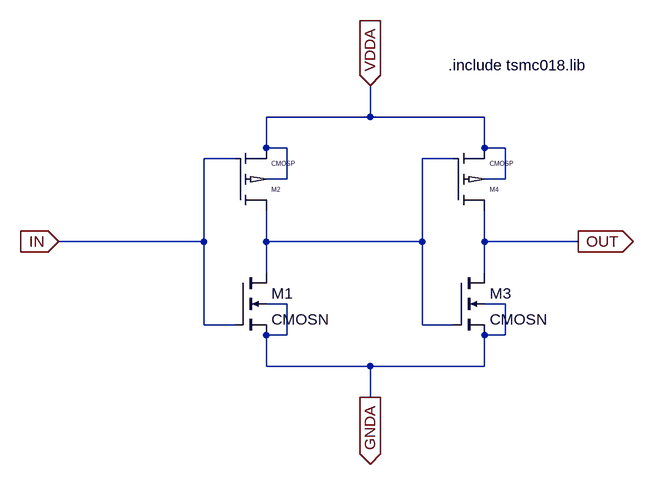
[diagram p0: schematic Matched_Buffer.asc]
Matched_Buffer.asc, the LTspice schematic file:
Version 4
SHEET 1 880 680
WIRE 224 -16 224 -64
WIRE 224 -16 64 -16
WIRE 400 -16 224 -16
WIRE 64 32 64 -16
WIRE 96 32 64 32
WIRE 400 32 400 -16
WIRE 432 32 400 32
WIRE 16 48 -32 48
WIRE 352 48 304 48
WIRE 96 80 96 32
WIRE 96 80 64 80
WIRE 432 80 432 32
WIRE 432 80 400 80
WIRE -32 176 -32 48
WIRE -32 176 -256 176
WIRE 64 176 64 128
WIRE 304 176 304 48
WIRE 304 176 64 176
WIRE 400 176 400 128
WIRE 544 176 400 176
WIRE 64 224 64 176
WIRE 400 224 400 176
WIRE 96 272 64 272
WIRE 432 272 400 272
WIRE -32 304 -32 176
WIRE 16 304 -32 304
WIRE 304 304 304 176
WIRE 352 304 304 304
WIRE 96 320 96 272
WIRE 96 320 64 320
WIRE 432 320 432 272
WIRE 432 320 400 320
WIRE 64 368 64 320
WIRE 224 368 64 368
WIRE 400 368 400 320
WIRE 400 368 224 368
WIRE 224 416 224 368
FLAG 224 -64 VDDA
IOPIN 224 -64 In
FLAG 224 416 GNDA
IOPIN 224 416 Out
FLAG -256 176 IN
IOPIN -256 176 In
FLAG 544 176 OUT
IOPIN 544 176 Out
SYMBOL cmosn 16 224 R0
SYMATTR InstName M1
SYMATTR Value2 l=180n w=1u
SYMBOL cmosp 16 128 M180
SYMATTR InstName M2
SYMATTR Value2 l=180n w=5u
SYMBOL cmosn 352 224 R0
SYMATTR InstName M3
SYMATTR Value2 l=180n w=4u
SYMBOL cmosp 352 128 M180
SYMATTR InstName M4
SYMATTR Value2 l=180n w=20u
TEXT 344 -96 Left 2 !.include tsmc018.lib

The netlist it stands for:
* Matched_Buffer.asc
M1 N001 IN GNDA GNDA CMOSN l=180n w=1u
M2 N001 IN VDDA VDDA CMOSP l=180n w=5u
M3 OUT N001 GNDA GNDA CMOSN l=180n w=4u
M4 OUT N001 VDDA VDDA CMOSP l=180n w=20u
.model NMOS NMOS
.model PMOS PMOS
.lib standard.mos
.include tsmc018.lib
.lib tsmc018.lib
.backanno
.end